# Altium schematic sheet P[09]_eMMC_QSPI.SchDoc
size A3
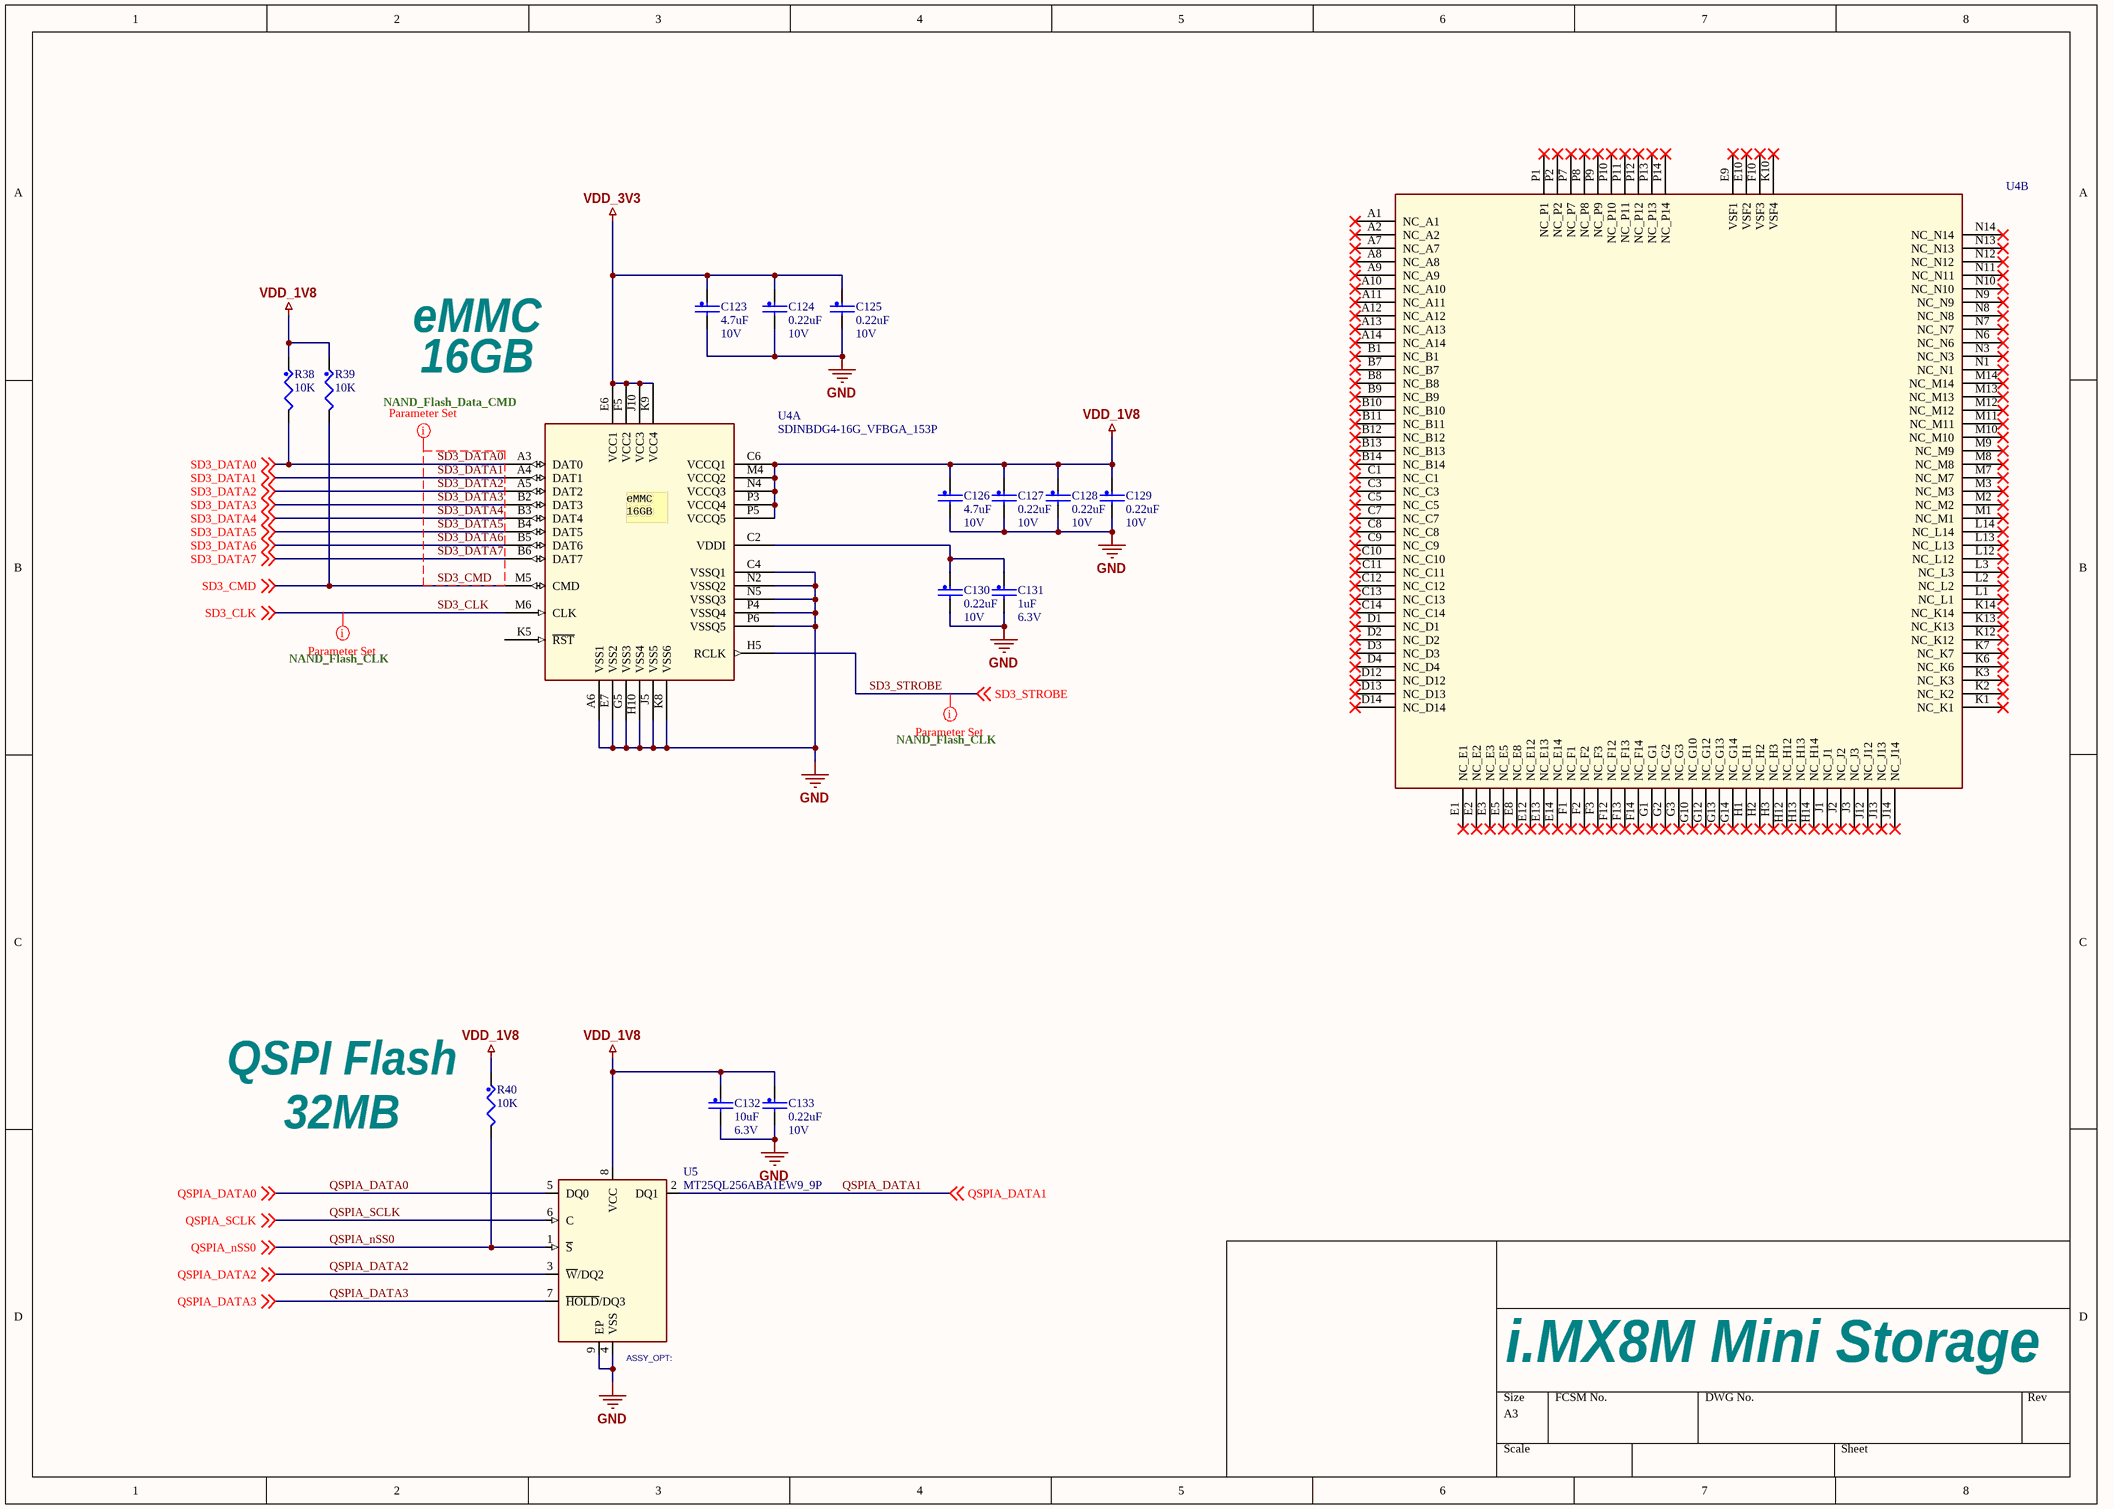
[diagram p0: P[09]_eMMC_QSPI.SchDoc]

## Parts
C123  4.7uF  Voltage: 10V  [0402_CC - C]
C124  0.22uF  Voltage: 10V  [0201_CC - C]
C125  0.22uF  Voltage: 10V  [0201_CC - C]
C126  4.7uF  Voltage: 10V  [0402_CC - C]
C127  0.22uF  Voltage: 10V  [0201_CC - C]
C128  0.22uF  Voltage: 10V  [0201_CC - C]
C129  0.22uF  Voltage: 10V  [0201_CC - C]
C130  0.22uF  Voltage: 10V  [0201_CC - C]
C131  1uF  Voltage: 6.3V  [0201_CC - C]
C132  10uF  Voltage: 6.3V  [0402_CC - C]
C133  0.22uF  Voltage: 10V  [0201_CC - C]
R38  10K  [0201_CC]
R39  10K  [0201_CC]
R40  10K  [0402_CC]
U4  SDINBDG4-16G_VFBGA_153P  [FBGA153_0P5_11P5X13]  (parts A,B of 2)
U5  MT25QL256ABA1EW9_9P  [DFN8_1P27_6X5MM_3P1]

## Nets
GND: C123.2 C124.2 C125.2 C126.2 C127.2 C128.2 C129.2 C130.2 C131.2 C132.2 C133.2 U4.A6(VSS1) U4.C4(VSSQ1) U4.E7(VSS2) U4.G5(VSS3) U4.H10(VSS4) U4.J5(VSS5) U4.K8(VSS6) U4.N2(VSSQ2) U4.N5(VSSQ3) U4.P4(VSSQ4) U4.P6(VSSQ5) U5.4(VSS) U5.9(EP)
VDD_1V8: C126.1 C127.1 C128.1 C129.1 C132.1 C133.1 R38.1 R39.1 R40.1 U4.C6(VCCQ1) U4.M4(VCCQ2) U4.N4(VCCQ3) U4.P3(VCCQ4) U4.P5(VCCQ5) U5.8(VCC)
VDD_3V3: C123.1 C124.1 C125.1 U4.E6(VCC1) U4.F5(VCC2) U4.J10(VCC3) U4.K9(VCC4)
QSPIA_DATA0: U5.5(DQ0) ; off-sheet QSPIA_DATA0
QSPIA_DATA1: U5.2(DQ1) ; off-sheet QSPIA_DATA1
QSPIA_DATA2: U5.3(~{W}/DQ2) ; off-sheet QSPIA_DATA2
QSPIA_DATA3: U5.7(~{HOLD}/DQ3) ; off-sheet QSPIA_DATA3
QSPIA_nSS0: R40.2 U5.1(~{S}) ; off-sheet QSPIA_nSS0
QSPIA_SCLK: U5.6(C) ; off-sheet QSPIA_SCLK
SD3_CLK: U4.M6(CLK) ; off-sheet SD3_CLK
SD3_CMD: R39.2 U4.M5(CMD) ; off-sheet SD3_CMD
SD3_DATA0: R38.2 U4.A3(DAT0) ; off-sheet SD3_DATA0
SD3_DATA1: U4.A4(DAT1) ; off-sheet SD3_DATA1
SD3_DATA2: U4.A5(DAT2) ; off-sheet SD3_DATA2
SD3_DATA3: U4.B2(DAT3) ; off-sheet SD3_DATA3
SD3_DATA4: U4.B3(DAT4) ; off-sheet SD3_DATA4
SD3_DATA5: U4.B4(DAT5) ; off-sheet SD3_DATA5
SD3_DATA6: U4.B5(DAT6) ; off-sheet SD3_DATA6
SD3_DATA7: U4.B6(DAT7) ; off-sheet SD3_DATA7
SD3_STROBE: U4.H5(RCLK) ; off-sheet SD3_STROBE
NetC130_1: C130.1 C131.1 U4.C2(VDDI)

Not connected (* = marked no-connect by the designer): U4 A1(NC_A1)* A2(NC_A2)* A7(NC_A7)* A8(NC_A8)* A9(NC_A9)* A10(NC_A10)* A11(NC_A11)* A12(NC_A12)* A13(NC_A13)* A14(NC_A14)* B1(NC_B1)* B7(NC_B7)* B8(NC_B8)* B9(NC_B9)* B10(NC_B10)* B11(NC_B11)* B12(NC_B12)* B13(NC_B13)* B14(NC_B14)* C1(NC_C1)* C3(NC_C3)* C5(NC_C5)* C7(NC_C7)* C8(NC_C8)* C9(NC_C9)* C10(NC_C10)* C11(NC_C11)* C12(NC_C12)* C13(NC_C13)* C14(NC_C14)* D1(NC_D1)* D2(NC_D2)* D3(NC_D3)* D4(NC_D4)* D12(NC_D12)* D13(NC_D13)* D14(NC_D14)* E1(NC_E1)* E2(NC_E2)* E3(NC_E3)* E5(NC_E5)* E8(NC_E8)* E9(VSF1)* E10(VSF2)* E12(NC_E12)* E13(NC_E13)* E14(NC_E14)* F1(NC_F1)* F2(NC_F2)* F3(NC_F3)* F10(VSF3)* F12(NC_F12)* F13(NC_F13)* F14(NC_F14)* G1(NC_G1)* G2(NC_G2)* G3(NC_G3)* G10(NC_G10)* G12(NC_G12)* G13(NC_G13)* G14(NC_G14)* H1(NC_H1)* H2(NC_H2)* H3(NC_H3)* H12(NC_H12)* H13(NC_H13)* H14(NC_H14)* J1(NC_J1)* J2(NC_J2)* J3(NC_J3)* J12(NC_J12)* J13(NC_J13)* J14(NC_J14)* K1(NC_K1)* K2(NC_K2)* K3(NC_K3)* K5(~{RST}) K6(NC_K6)* K7(NC_K7)* K10(VSF4)* K12(NC_K12)* K13(NC_K13)* K14(NC_K14)* L1(NC_L1)* L2(NC_L2)* L3(NC_L3)* L12(NC_L12)* L13(NC_L13)* L14(NC_L14)* M1(NC_M1)* M2(NC_M2)* M3(NC_M3)* M7(NC_M7)* M8(NC_M8)* M9(NC_M9)* M10(NC_M10)* M11(NC_M11)* M12(NC_M12)* M13(NC_M13)* M14(NC_M14)* N1(NC_N1)* N3(NC_N3)* N6(NC_N6)* N7(NC_N7)* N8(NC_N8)* N9(NC_N9)* N10(NC_N10)* N11(NC_N11)* N12(NC_N12)* N13(NC_N13)* N14(NC_N14)* P1(NC_P1)* P2(NC_P2)* P7(NC_P7)* P8(NC_P8)* P9(NC_P9)* P10(NC_P10)* P11(NC_P11)* P12(NC_P12)* P13(NC_P13)* P14(NC_P14)*

## Layout directives
net class NAND_Flash_Data_CMD: SD3_CMD, SD3_DATA0, SD3_DATA1, SD3_DATA2, SD3_DATA3, SD3_DATA4, SD3_DATA5, SD3_DATA6, SD3_DATA7
net class NAND_Flash_CLK: SD3_CLK, SD3_STROBE

## Notes on the sheet
- eMMC
- (near U4) 16GB
- (near R40) QSPI Flash
- 32MB
- i.MX8M Mini Storage
- (in symbol SDINBDG4-16G_VFBGA_153P, part A) eMMC / 16GB

## Library data of the parts
C123-C133 = CAP_NP: CLASS: DISCRETE
R38-R40 = RES: CLASS: DISCRETE
U4 = SDINBDG4-16G_VFBGA_153P: CLASS: IC
U5 = MT25QL256ABA1EW9_9P: CLASS: IC